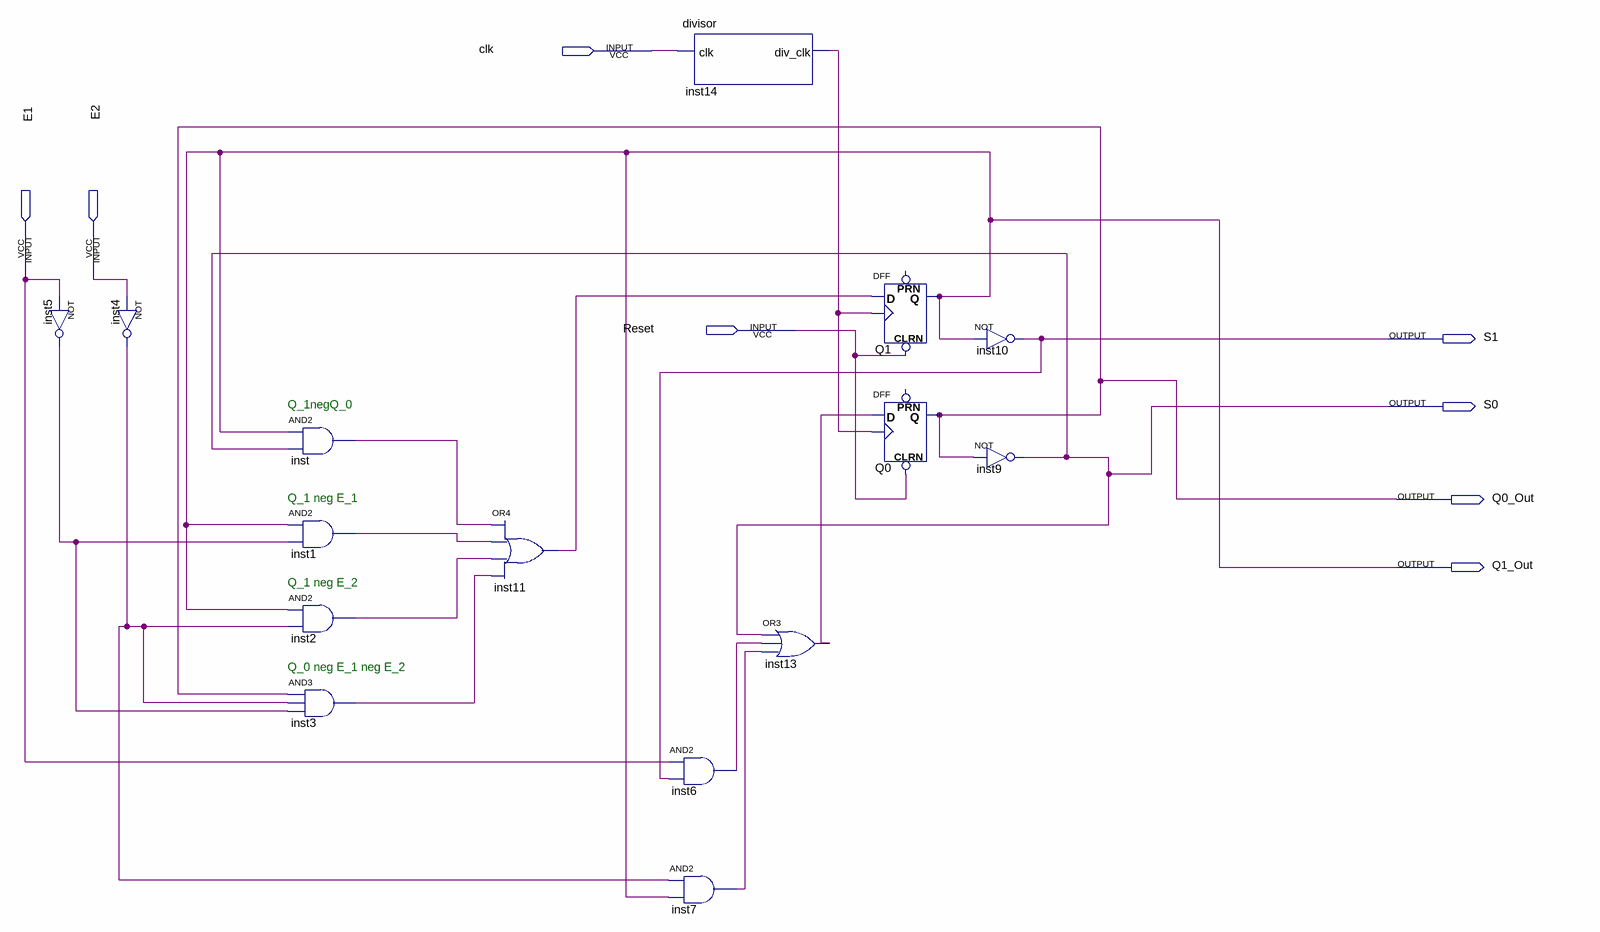
[diagram p0: schematic sheet]
// Quartus schematic practica2ffd.bdf as structural Verilog: 15 symbols, 8 pins
module practica2ffd (
  input  clk,
  input  E1,
  input  E2,
  input  Reset,
  output S1,
  output S0,
  output Q0_Out,
  output Q1_Out
);

  wire inst1_out, inst2_out, inst3_out, inst4_out, inst5_out, inst6_out, inst7_out, inst11_out, inst13_out,
       inst14_div_clk, inst_out;

  not inst5 (inst5_out, E1);
  not inst4 (inst4_out, E2);
  and inst (inst_out, Q1_Out, S0);
  and inst1 (inst1_out, Q1_Out, inst5_out);
  and inst2 (inst2_out, Q1_Out, inst4_out);
  and inst3 (inst3_out, Q0_Out, inst4_out, inst5_out);
  or inst11 (inst11_out, inst_out, inst1_out, inst2_out, inst3_out);
  and inst6 (inst6_out, E1, S1);
  and inst7 (inst7_out, inst4_out, Q1_Out);
  divisor inst14 (.clk(clk), .div_clk(inst14_div_clk));
  or inst13 (inst13_out, S0, inst6_out, inst7_out);
  DFF Q1 (.CLRN(Reset), .CLK(inst14_div_clk), .D(inst11_out), .Q(Q1_Out));  // open: PRN
  DFF Q0 (.CLRN(Reset), .CLK(inst14_div_clk), .D(inst13_out), .Q(Q0_Out));  // open: PRN
  not inst10 (S1, Q1_Out);
  not inst9 (S0, Q0_Out);

  // Notes on the sheet:
  //   Q_1negQ_0
  //   Q_1 neg E_1
  //   Q_1 neg E_2
  //   Q_0 neg E_1 neg E_2
endmodule
